# EAGLE design imwiser-esp-v01 (EAGLE 7.5.0)
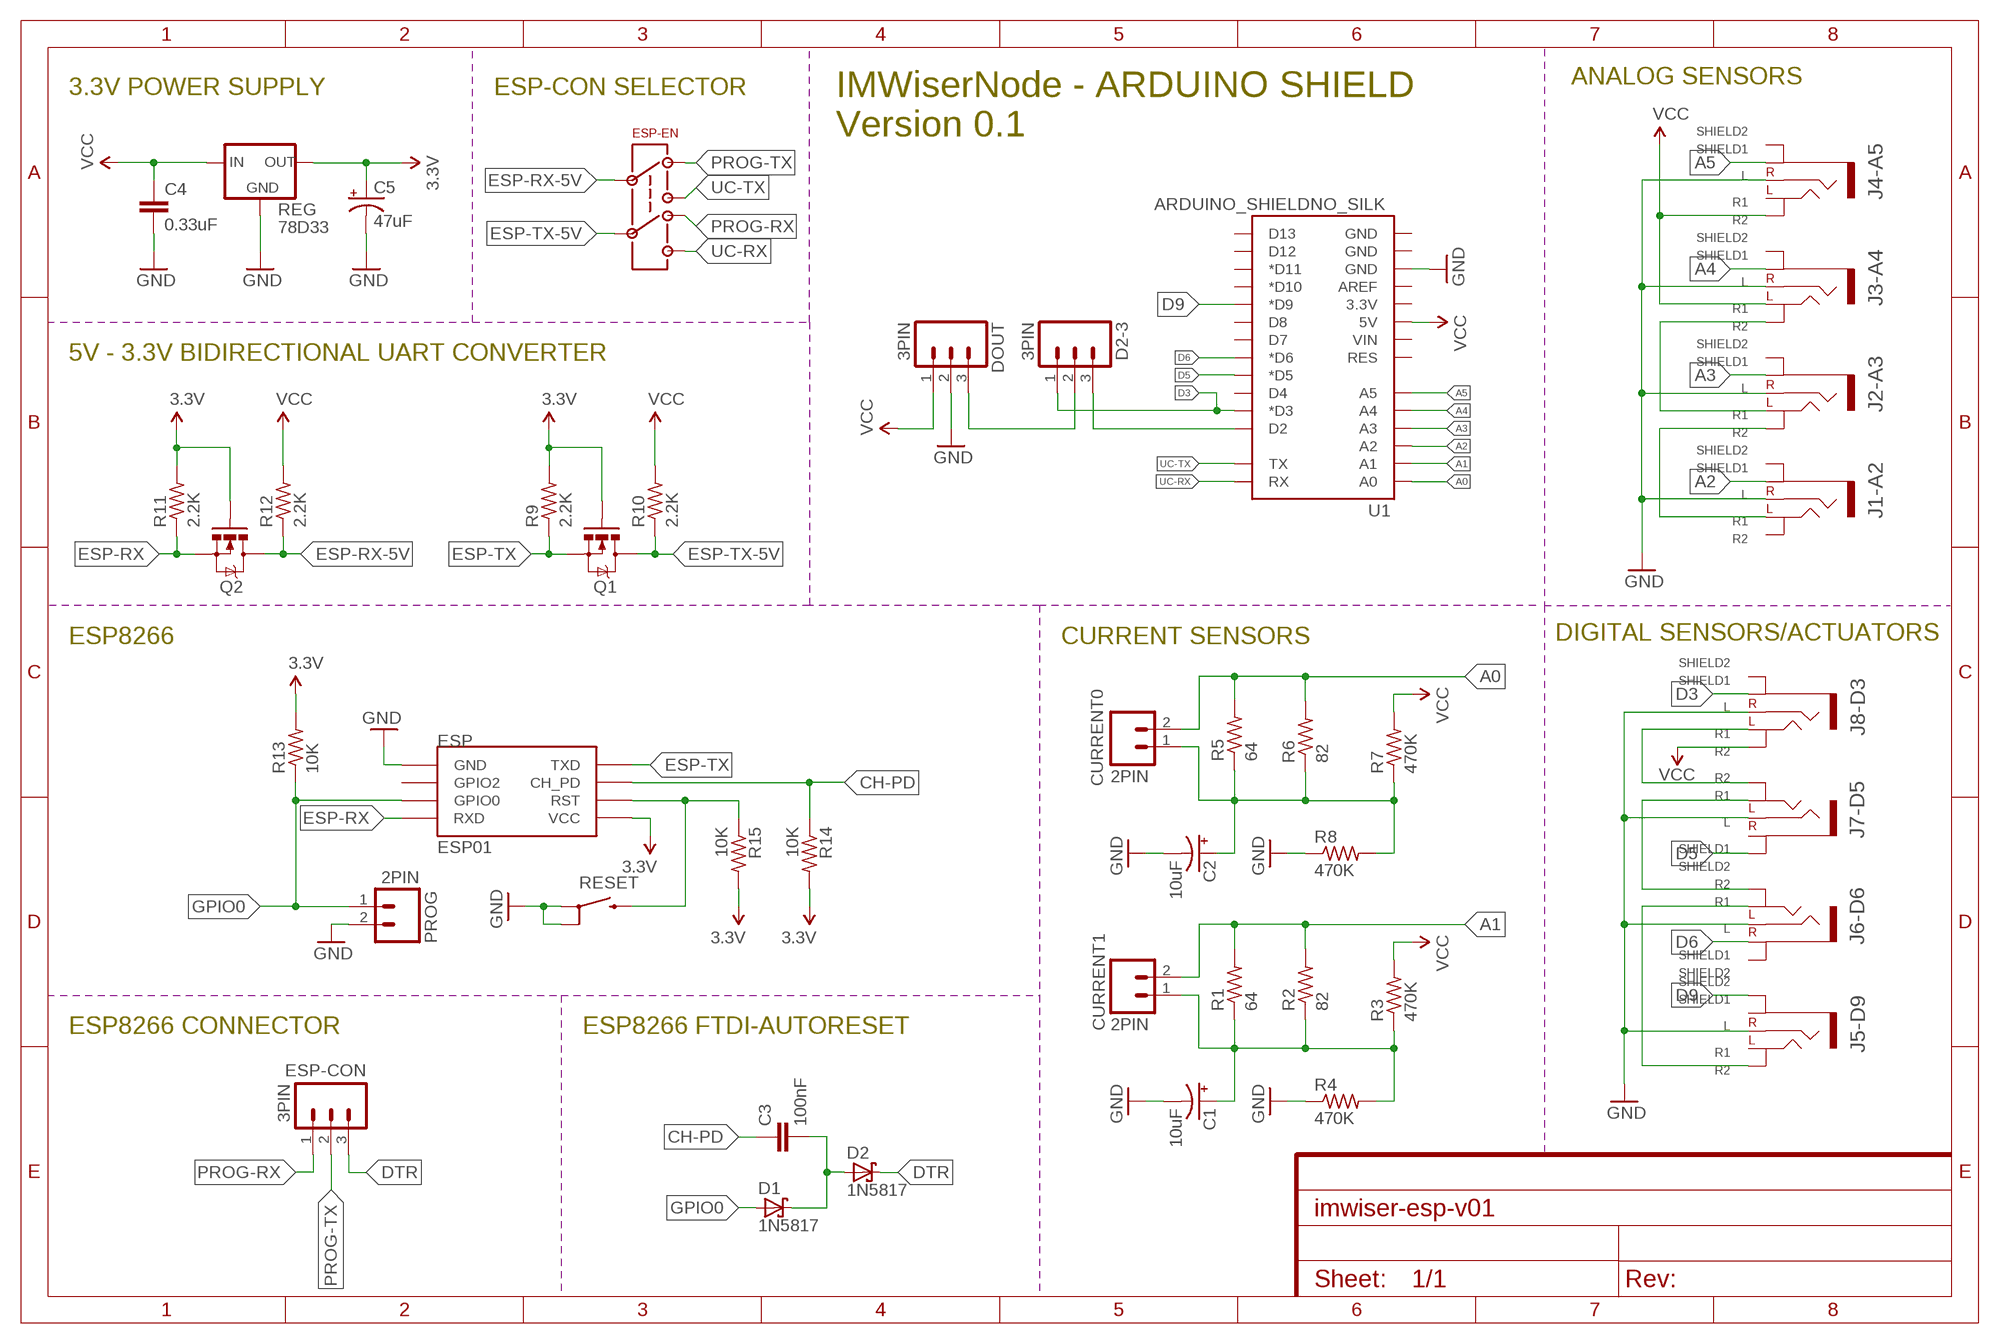
[diagram p0: schematic, sheet 1]
FRAME1 (FRAME-A4L): CNAME: IMSensorNode; CREVISION: REV A; DESIGNER: Jeferson Lima

## Parts
C1  10uF  10UF-25V-20%(PTH)  [CPOL-RADIAL-10UF-25V]
C2  10uF  10UF-25V-20%(PTH)  [CPOL-RADIAL-10UF-25V]
C3  100nF  CAPPTH  [CAP-PTH-SMALL]
C4  0.33uF  CAPPTH  [CAP-PTH-SMALL]
C5  47uF  10UF-25V-20%(PTH)  [CPOL-RADIAL-10UF-25V]
CURRENT0  2PIN  M02PTH  [1X02]
CURRENT1  2PIN  M02PTH  [1X02]
D1  1N5817  SCHOTTKY-DIODEDO41-7  [DO41-7]
D2  1N5817  SCHOTTKY-DIODEDO41-7  [DO41-7]
D2-3  3PIN  M03PTH  [1X03]
DOUT  3PIN  M03PTH  [1X03]
ESP  ESP01  [ESP01]
ESP-CON  3PIN  M03PTH  [1X03]
ESP-EN  DPDT-GENERIC-SWITCH-7X7MM  [DPDT-PTH-7*7MM]
J1-A2  PJ-313-SPAD  [PJ-313-5PIN-SMALL]
J2-A3  PJ-313-SPAD  [PJ-313-5PIN-SMALL]
J3-A4  PJ-313-SPAD  [PJ-313-5PIN-SMALL]
J4-A5  PJ-313-SPAD  [PJ-313-5PIN-SMALL]
J5-D9  PJ-313-SPAD  [PJ-313-5PIN-SMALL]
J6-D6  PJ-313-SPAD  [PJ-313-5PIN-SMALL]
J7-D5  PJ-313-SPAD  [PJ-313-5PIN-SMALL]
J8-D3  PJ-313-SPAD  [PJ-313-5PIN-SMALL]
PROG  2PIN  M02PTH  [1X02]
Q1  MOSFET-NCHANNEL2N7000  [TO-92]
Q2  MOSFET-NCHANNEL2N7000  [TO-92]
R1  64  R-US_0207/10  [0207/10]
R2  82  R-US_0207/10  [0207/10]
R3  470K  R-US_0207/10  [0207/10]
R4  470K  R-US_0207/10  [0207/10]
R5  64  R-US_0207/10  [0207/10]
R6  82  R-US_0207/10  [0207/10]
R7  470K  R-US_0207/10  [0207/10]
R8  470K  R-US_0207/10  [0207/10]
R9  2.2K  R-US_0207/10  [0207/10]
R10  2.2K  R-US_0207/10  [0207/10]
R11  2.2K  R-US_0207/10  [0207/10]
R12  2.2K  R-US_0207/10  [0207/10]
R13  10K  R-US_0207/10  [0207/10]
R14  10K  R-US_0207/10  [0207/10]
R15  10K  R-US_0207/10  [0207/10]
REG  78D33  V_REG_78XXSINK  [TO220-IGO]
RESET  SWITCH-MOMENTARY-2PTH  [TACTILE-PTH]
U1  ARDUINO_SHIELDNO_SILK  [DUEMILANOVE_VIAS]

## Nets
3.3V: C5.1(+) ESP.VCC Q1.2(G) Q2.2(G) R9.2 R11.2 R13.2 R14.2 R15.2 REG.OUT
A0: CURRENT0.2 R5.2 R6.2 U1.A0
A1: CURRENT1.2 R1.2 R2.2 U1.A1
A2: J1-A2.1.1(SHIELD1) U1.A2
A3: J2-A3.1.1(SHIELD1) U1.A3
A4: J3-A4.1.1(SHIELD1) U1.A4
A5: J4-A5.1.1(SHIELD1) U1.A5
BURDEN-C0: C2.1(+) CURRENT0.1 R5.1 R6.1 R7.1 R8.2
BURDEN-C1: C1.1(+) CURRENT1.1 R1.1 R2.1 R3.1 R4.2
CH-PD: C3.1 ESP.CH_PD R14.1
D3: D2-3.1 J8-D3.1.1(SHIELD1) U1.D3(*D3)
D5: J7-D5.1.2(SHIELD2) U1.D5(*D5)
D6: J6-D6.1.1(SHIELD1) U1.D6(*D6)
D9: J5-D9.1.2(SHIELD2) U1.D9(*D9)
DTR: D2.C ESP-CON.3
ESP-RX: ESP.RX(RXD) Q2.1(S) R11.1
ESP-RX-5V: ESP-EN.3-IN1(IN1) Q2.3(D) R12.1
ESP-TX: ESP.TX(TXD) Q1.1(S) R9.1
ESP-TX-5V: ESP-EN.4-IN2(IN2) Q1.3(D) R10.1
GND: C1.2(-) C2.2(-) C4.2 C5.2(-) DOUT.2 ESP.GND J1-A2.2(R) J2-A3.2(R) J3-A4.2(R) J4-A5.2(R) J5-D9.2(R) J6-D6.2(R) J7-D5.2(R) J8-D3.2(R) PROG.2 R4.1 R8.1 REG.GND RESET.1 RESET.2 U1.GND@2(GND)
GPIO0: D1.A ESP.GPIO0 PROG.1 R13.1
N$1: J2-A3.3.1(L1) J3-A4.3.2(L2)
N$2: J1-A2.3.1(L1) J2-A3.3.2(L2)
N$7: J7-D5.3.2(L2) J8-D3.3.1(L1)
N$8: D2-3.2 DOUT.3
N$9: J6-D6.3.2(L2) J7-D5.3.1(L1)
N$14: D2-3.3 U1.D2
N$16: J5-D9.3.2(L2) J6-D6.3.1(L1)
PROG-RX: ESP-CON.1 ESP-EN.2-OUT2-A(OUT2-A)
PROG-TX: ESP-CON.2 ESP-EN.1-OUT1-A(OUT1-A)
RST: ESP.RST R15.1 RESET.3
U$1: C3.2 D1.C D2.A
UC-RX: ESP-EN.6-OUT2-B(OUT2-B) U1.RX
UC-TX: ESP-EN.5-OUT1-B(OUT1-B) U1.TX
VCC: C4.1 DOUT.1 J3-A4.3.1(L1) J4-A5.3.2(L2) J8-D3.3.2(L2) R3.2 R7.2 R10.2 R12.2 REG.IN U1.5V
Unconnected: ESP.GPIO2 J1-A2.1.2(SHIELD2) J1-A2.3.2(L2) J2-A3.1.2(SHIELD2) J3-A4.1.2(SHIELD2) J4-A5.1.2(SHIELD2) J4-A5.3.1(L1) J5-D9.1.1(SHIELD1) J5-D9.3.1(L1) J6-D6.1.2(SHIELD2) J7-D5.1.1(SHIELD1) J8-D3.1.2(SHIELD2) U1.3.3V U1.AREF U1.D4 U1.D7 U1.D8 U1.D10(*D10) U1.D11(*D11) U1.D12 U1.D13 U1.GND@0(GND) U1.GND@1(GND) U1.RES U1.VIN

## Notes on the sheet
- IMWiserNode - ARDUINO SHIELD
  Version 0.1
- ANALOG SENSORS
- 3.3V POWER SUPPLY | ESP-CON SELECTOR
- 5V - 3.3V BIDIRECTIONAL UART CONVERTER
- ESP8266 | CURRENT SENSORS | DIGITAL SENSORS/ACTUATORS
- ESP8266 CONNECTOR | ESP8266 FTDI-AUTORESET

## Library data of the parts
C1 C2 C5 = SparkFun-Capacitors:10UF-25V-20%(PTH): CAP-08440; PROD_ID: CAP-08440
C3 C4 = SparkFun-Capacitors:CAP: Capacitor Standard 0603 ceramic capacitor, and 0.1" leaded capacitor.
CURRENT0 CURRENT1 PROG = SparkFun-Connectors:M02: Standard 2-pin 0.1" header. Use with - straight break away headers ( PRT-00116) - right angle break away headers (PRT-00553) - swiss pins (PRT-00743) - machine pins (PRT-00117) - female headers (PRT-00115) Molex polarized connector foot print use with: PRT-08233 with associated crimp pins and housings. 2.54_SCREWTERM for use with PRT-10571. 3.5mm Screw Terminal footprints for PRT-08084 5mm Screw Terminal footprints for use with PRT-08432
D1 D2 = adafruit:SCHOTTKY-DIODE: Schottky Diode
D2-3 DOUT ESP-CON = SparkFun-Connectors:M03: Header 3 Standard 3-pin 0.1" header. Use with straight break away headers (SKU : PRT-00116), right angle break away headers (PRT-00553), swiss pins (PRT-00743), machine pins (PRT-00117), and female headers (PRT-00115). Molex polarized connector foot print use with SKU : PRT-08232 with associated crimp pins and housings.
ESP = esp8266-modules:ESP01: ESP8266 Wifi module 01
ESP-EN = salvador-parts:DPDT-GENERIC-SWITCH-7X7MM
J1-A2 J2-A3 J3-A4 J4-A5 J5-D9 J6-D6 J7-D5 J8-D3 = salvador-parts:PJ-313-SPAD: PJ-313 with octagon pads PJ-313 with small octagon pads, good for projects which need small footprints
Q1 Q2 = SparkFun-DiscreteSemi:MOSFET-NCHANNEL: Common NMOSFET Parts MFG P/N Store ID Prod ID FDD8780 TRANS-09984 SI7820DN TRANS-11055 FDS6630A IC-08089 2N7002PW TRANS-11151 FQP30N06L COM-10213 TRANS-10060 BSS123LT1G TRANS-08345 BSS138 TRANS-00830 BS170 2N7000
R1-R15 = resistor:R-US_: RESISTOR, American symbol
REG = salvador-parts-imported:V_REG_78XX: Voltage Regulator Standard 78xx regulator. IGO (Input Ground Output). Spark Fun Electronics SKU : COM-00107
RESET = salvador-parts-imported2:SWITCH-MOMENTARY-2: Various NO switches- pushbuttons, reed, etc; PROD_ID: SWCH-08441
U1 = SparkFun-Boards:ARDUINO_SHIELD: Arduino shield footprint

## Board
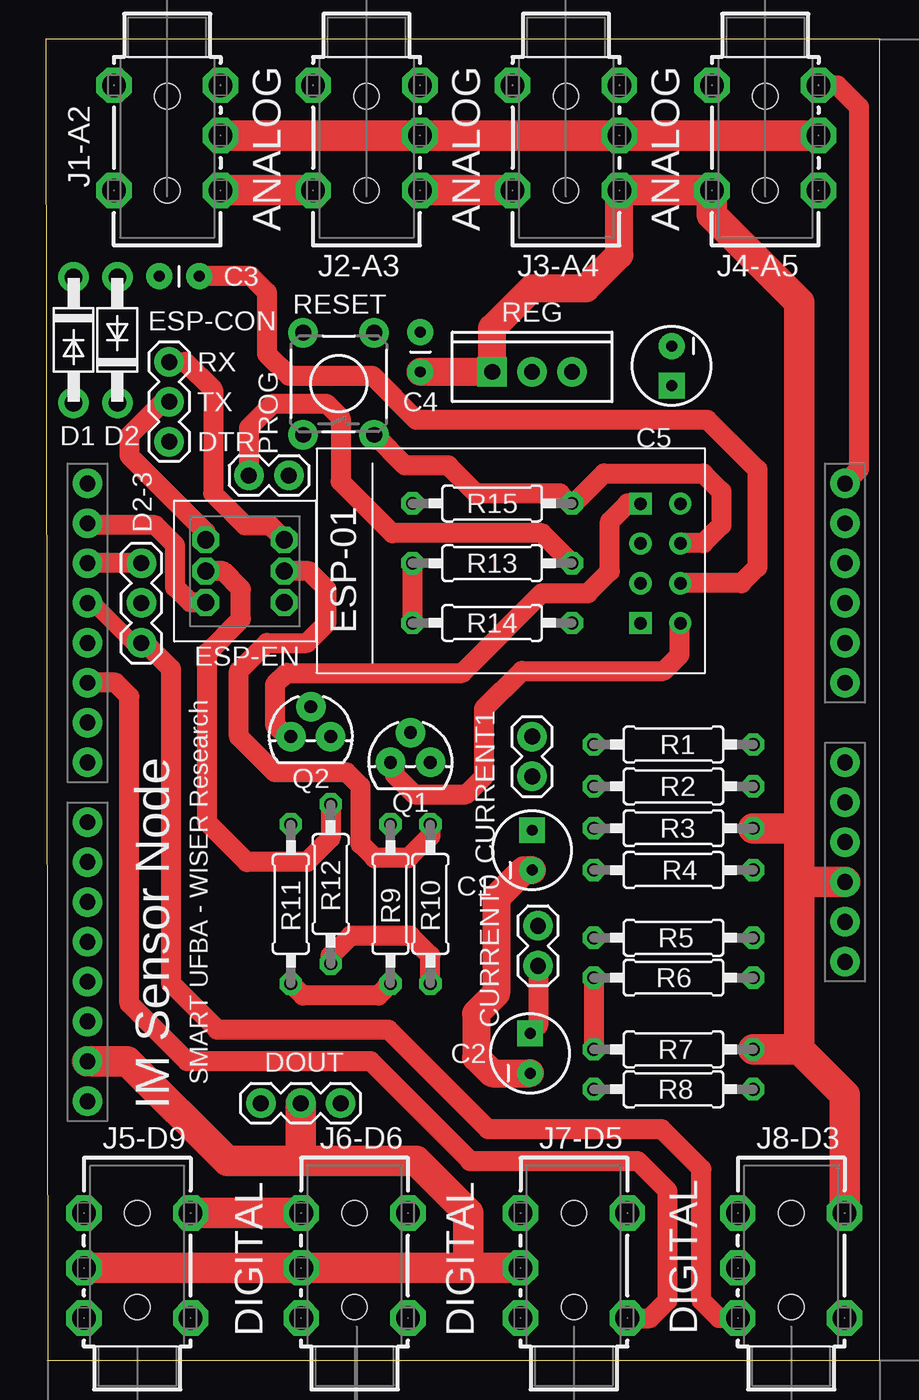
[diagram p1: board, top side]
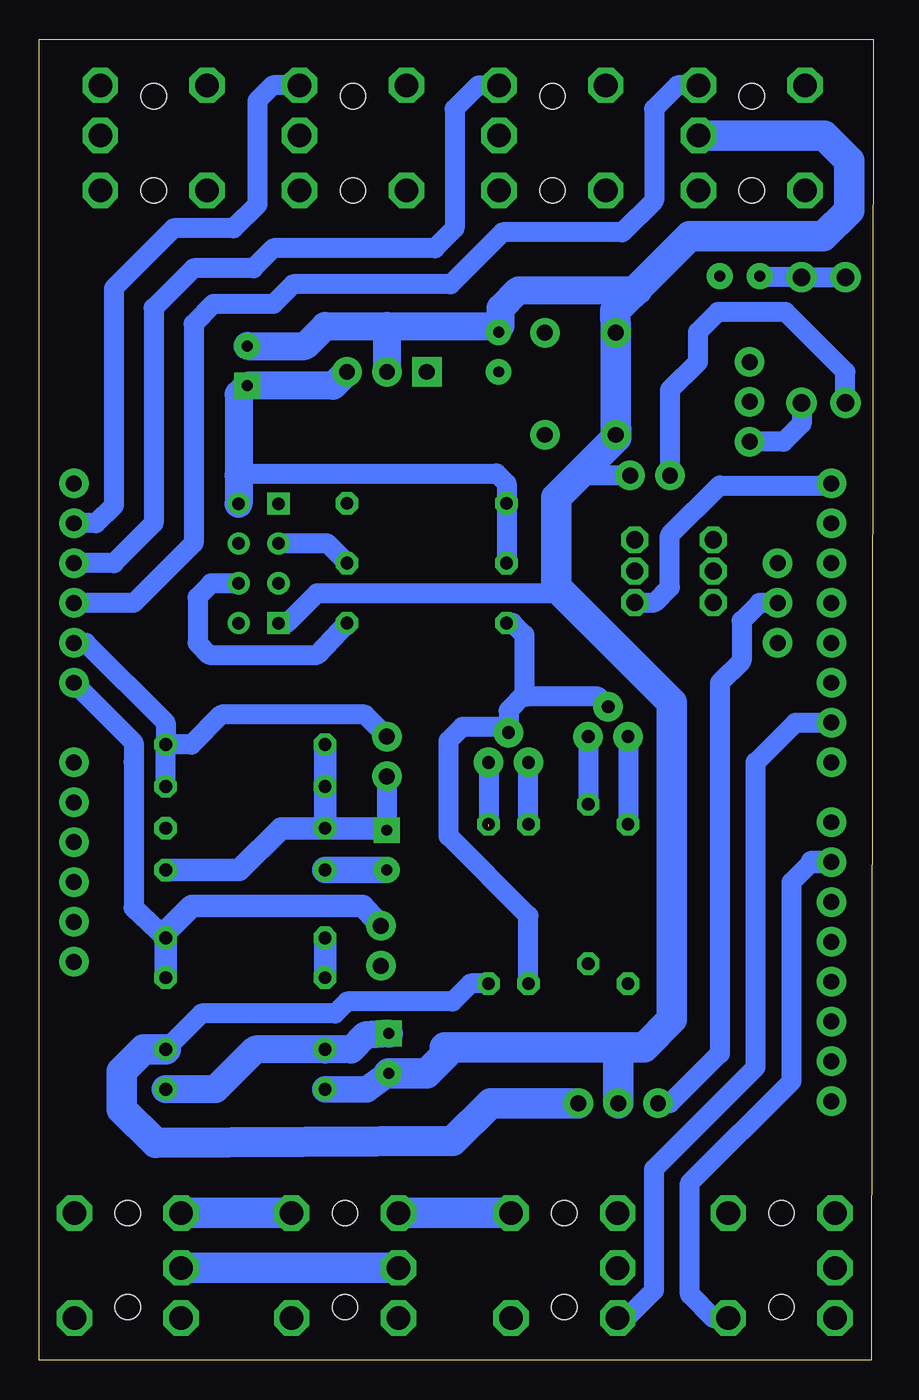
[diagram p2: board, bottom side, seen from below]

Size 53.14 x 84.19 mm. Coordinates in mm from the lower left corner, seen from the top.
Outline: 0.13,0 53.14,0 53.14,84.19 0,84.19 0.13,0
Copper layers (1*16): Top 0.035mm / dielectric 1.5mm / Bottom 0.035mm
Design rules "default": minimum track width 8mil, minimum drill 20mil, track to track 8mil, track to pad 8mil, pad to pad 8mil, via to via 8mil, smd to smd 8mil, copper to edge 10mil, drill to drill 8mil, minimum pad ring 12mil, minimum via ring 10mil, stop-mask expansion 4mil, vias tented up to drill 25mil, thermal gap 10mil

### Footprints (pad centres in the part's own frame; a part is rotated, then mirrored left to right if it is on the bottom)
CPOL-RADIAL-10UF-25V = drill 0.7 pad 1.651 square: 1 1.27,0 | drill 0.7 pad 1.651: 2 -1.27,0
CAP-PTH-SMALL = drill 0.7 pad 1.651: 1 0,0; 2 2.54,0
1X02 = drill 1.016 pad 1.88: 1 0,0; 2 2.54,0
DO41-7 = drill 1.118 pad 1.93: A 4,0; C -4,0
1X03 = drill 1.016 pad 1.88: 1 0,0; 2 2.54,0; 3 5.08,0
ESP01 = drill 0.8: CH_PD -1.285,-8.178; GPIO0 1.255,-5.638; GPIO2 -1.285,-5.638; RST 1.255,-8.178; TX -3.825,-8.178; VCC 3.795,-8.178 | drill 0.8 square: GND -3.825,-5.638; RX 3.795,-5.638
DPDT-PTH-7*7MM = drill 1.1 octagon: 1-OUT1-A -2.5,2; 2-OUT2-A 2.5,2; 3-IN1 -2.5,0; 4-IN2 2.5,0; 5-OUT1-B -2.5,-2; 6-OUT2-B 2.5,-2
PJ-313-5PIN-SMALL = drill 1.5 octagon: 1.1 1.8,3.4; 1.2 1.8,-3.4; 2 5,3.4; 3.1 8.5,3.4; 3.2 8.5,-3.4 | hole 1.6: 2.5,0; 8.5,0
TO-92 = drill 0.813 pad 1.88: 1 -1.27,0; 2 0,1.905; 3 1.27,0
0207/10 = drill 0.813 octagon: 1 -5.08,0; 2 5.08,0
TO220-IGO = drill 1 pad 1.88: GND 0,0; OUT 2.54,0 | drill 1 pad 1.88 square: IN -2.54,0
TACTILE-PTH = drill 1.016 pad 1.88: 1 -3.251,2.261; 2 3.251,2.261; 3 -3.251,-2.261; 4 3.251,-2.261
DUEMILANOVE_VIAS = drill 1.016 pad 1.88: 3.3V 50.8,13.97; 5V 50.8,16.51; A0 50.8,29.21; A1 50.8,31.75; A2 50.8,34.29; A3 50.8,36.83; A4 50.8,39.37; A5 50.8,41.91; AREF 2.54,2.54; D2 2.54,36.83; D3 2.54,34.29; D4 2.54,31.75; D5 2.54,29.21; D6 2.54,26.67; D7 2.54,24.13; D8 2.54,20.32; D9 2.54,17.78; D10 2.54,15.24; D11 2.54,12.7; D12 2.54,10.16; D13 2.54,7.62; GND@0 50.8,19.05; GND@1 50.8,21.59; GND@2 2.54,5.08; RES 50.8,11.43; RX 2.54,41.91; TX 2.54,39.37; VIN 50.8,24.13

### Placement (x,y rotation side)
C1  30.99,32.51 90 top
C2  30.86,19.56 90 top
C3  9.78,69.09 180 top
C4  23.88,62.99 90 top
C5  39.88,63.37 270 top
CURRENT0  31.37,25.15 90 top
CURRENT1  30.99,37.21 90 top
D1  1.78,65.02 270 top
D2  4.57,65.02 90 top
D2-3  6.1,45.72 90 top
DOUT  18.8,16.38 180 top
ESP  32.26,50.8 90 top
ESP-CON  7.87,63.63 270 top
ESP-EN  12.7,50.29 0 top
J1-A2  7.75,83.06 270 top
J2-A3  20.45,83.06 270 top
J3-A4  33.15,83.06 270 top
J4-A5  45.85,83.06 270 top
J5-D9  5.84,0.89 90 top
J6-D6  19.68,0.89 90 top
J7-D5  33.66,0.89 90 top
J8-D3  47.5,0.89 90 top
PROG  12.95,56.39 0 top
Q1  23.24,38.1 0 top
Q2  16.89,39.75 0 top
R1  40.01,39.24 0 top
R2  40.01,36.58 0 top
R3  40.01,33.91 0 top
R4  40.01,31.24 0 top
R5  40.01,26.92 0 top
R6  40.01,24.38 0 top
R7  40.01,19.81 0 top
R8  40.01,17.27 0 top
R9  21.97,29.08 270 top
R10  24.51,29.08 270 top
R11  15.62,29.08 270 top
R12  18.16,30.35 270 top
R13  28.45,50.8 180 top
R14  28.45,46.99 180 top
R15  28.45,54.61 180 top
REG  30.99,62.99 0 top
RESET  18.67,62.23 90 top
U1  0.13,13.97 0 top

### Tracks (layer width: path | path; a pad name or v marks a point on that pad's centre or on a via)
3.3V
  Top 1.27: R13.2 R14.2 | R9.2 21.21,23.24 16.38,23.24 R11.2
  Bottom 1.27: R13.2 R15.2 23.37,55.88 24,56.52 39.75,56.52 39.88,56.39 40.44,56.39 | Q2.2 17.53,42.29 22.1,42.29 22.22,42.42 | R9.2 21.97,28.32 27.05,33.4 27.05,39.5 26.16,40.39 23.49,40.39 Q1.2 23.24,41.4 22.22,42.42 | R14.2 22.99,46.99 22.22,46.23 22.22,42.42
  Bottom 1.778: REG.OUT 34.42,62.1 C5.1 40.44,61.55 40.44,56.39 ESP.VCC
A0
  Bottom 1.27: R5.2 47.12,28.83 47.12,38.1 47.12,39.37 U1.A0
  Bottom 1.422: R6.2 R5.2 45.09,27.3 43.43,28.96 32.51,28.96 CURRENT0.2
A1
  Bottom 1.27: R2.2 R1.2 | CURRENT1.2 32.39,41.15 41.53,41.15 43.43,39.24 R1.2 | R1.2 45.09,40.64 50.16,45.72 U1.A1
A2
  Bottom 1.27: J1-A2.1.1 12.47,81.26 13.97,79.76 13.97,73.91 16,71.88 23.62,71.88 26.92,68.58 36.96,68.58 38.23,67.31 42.04,67.31 43.31,66.04 43.31,52.07 47.12,48.26 U1.A2
A3
  Bottom 1.27: U1.A3 48.39,50.8 45.85,53.34 45.85,67.06 43.31,69.6 39.5,69.6 38.23,70.87 27.94,70.87 26.67,72.14 26.67,79.76 25.17,81.26 J2-A3.1.1
A4
  Bottom 1.27: J3-A4.1.1 38.25,81.26 39.24,80.26 39.24,73.66 40.77,72.14 44.58,72.14 48.39,68.33 48.39,54.48 49.53,53.34 U1.A4
A5
  Top 1.27: J4-A5.1.1 50.44,81.26 51.82,79.88 51.82,56.77 U1.A5
BURDEN-C0
  Top 1.27: R6.1 R7.1 | CURRENT0.1 31.37,21.34 C2.1
  Bottom 1.422: R5.1 R6.1
  Bottom 1.778: C2.1 32.39,20.7 33.27,19.81 R7.1 39.37,19.81 41.91,17.27 R8.2
BURDEN-C1
  Bottom 1.27: CURRENT1.1 30.99,33.91
  Bottom 1.422: R4.2 40.39,31.24 37.72,33.91 R3.1 | R3.1 R2.1 R1.1 | R3.1 30.99,33.91 C1.1
CH-PD
  Top 1.27: ESP.CH_PD 40.45,49.53 44.32,49.53 45.34,50.55 45.34,56.77 42.16,59.94 23.62,59.94 20.83,62.74 15.49,62.74 14.1,64.14 14.1,68.07 13.08,69.09 C3.1
  Bottom 1.27: ESP.CH_PD 42.18,49.52 43.05,48.64 43.05,45.72 42.29,44.96 35.43,44.96 R14.1
D3
  Top 1.016: U1.D3 3.05,48.26 5.59,45.72 D2-3.1
  Top 1.27: J8-D3.1.1 42.9,2.69 41.78,3.81 41.78,12.19 39.24,14.73 28.19,14.73 21.84,21.08 10.92,21.08 8,24 8,44.07 6.35,45.72 D2-3.1
D5
  Top 1.27: J7-D5.1.2 38.5,2.69 39.62,3.81 39.62,10.79 37.72,12.7 27.05,12.7 20.7,19.05 9.02,19.05 5.33,22.73 5.33,42.29 4.44,43.18 U1.D5
D6
  Bottom 1.27: J6-D6.1.1 15.73,2.69 13.97,4.45 13.97,12.19 7.49,18.67 7.49,38.1 4.95,40.64 U1.D6
D9
  Bottom 1.27: 3.94,31.75 5.21,30.48 5.21,17.78 11.68,11.3 11.68,4.19 10.18,2.69 J5-D9.1.2
  Bottom 1.422: 3.94,31.75 U1.D9
DTR
  Bottom 1.27: D2.C 4.57,59.69 5.71,58.55 ESP-CON.3
ESP-RX
  Top 1.27: Q2.1 15.37,39.75 14.61,40.51 14.61,43.05 15.37,43.81 26.54,43.81 31.62,48.9 34.54,48.9 35.94,50.29 35.94,53.47 37.08,54.61 37.88,54.61 ESP.RX
  Bottom 1.27: Q2.1 R11.1
ESP-RX-5V
  Top 1.27: R12.1 18.16,33.27 16.64,31.75 12.83,31.75 10.29,34.29 10.29,45.09 12.45,47.24 12.45,49.15 11.3,50.29 ESP-EN.3-IN1
  Bottom 1.27: Q2.3 R12.1
ESP-TX
  Top 1.27: ESP.TX 40.39,46.92 40.39,44.96 39.37,43.94 30.35,43.94 27.94,41.53 27.94,37.21 26.8,36.07 23.49,36.07 22.22,37.34 22.22,38.1 Q1.1
  Bottom 1.27: R9.1 Q1.1
ESP-TX-5V  (1 unrouted)
  Top 1.27: 24.51,34.04 24.51,33.4 23.11,32 20.95,32 20.07,32.89 20.07,36.58 19.18,37.47 14.61,37.47 12.32,39.75 12.32,43.94 14.1,45.72 16.64,45.72 17.91,46.99 17.91,49.15 16.76,50.29 ESP-EN.4-IN2
  Bottom 1.27: Q1.3 R10.1
GND
  Top 1.778: C1.2 30.48,31.24 28.7,29.46 28.7,23.37 27.43,22.1 27.43,19.3 28.45,18.29 C2.2
  Top 1.93: J1-A2.2 J2-A3.2 J3-A4.2 J4-A5.2 | DOUT.2 16.26,12.7 | 16.26,12.7 23.62,12.7 26.92,9.4 26.92,6.02 27.05,5.89 | U1.GND@2 5.21,19.05 11.56,12.7 16.26,12.7 | J5-D9.2 J6-D6.2 27.05,5.89 | J7-D5.2 27.05,5.89
  Bottom 1.27: ESP.GND 37.88,46.99 37.34,46.99 35.43,48.9 20.57,48.9 20.19,49.28 | 23.75,65.91 C4.2 | PROG.2 18.41,56.39 18.61,56.58
  Bottom 1.676: C2.2 32.26,17.27 R8.1 | R4.1 C1.2
  Bottom 1.778: C2.2 29.72,18.29 | C5.2 36.2,64.64 34.93,65.91 30.99,65.91 | 30.99,65.91 REG.GND | 30.99,65.91 23.75,65.91 23.75,67.06 22.61,68.2 14.96,68.2 16.43,66.88
  Bottom 1.93: 16.26,19.94 27.3,19.94 27.3,19.43 28.45,18.29 C2.2 | 16.26,19.94 14.61,19.94 12.83,21.72 12.83,41.91 20.19,49.28 20.19,54.99 18.61,56.58 16.38,58.8 16.38,59.33 RESET.1 RESET.2 16.43,66.88 11.68,71.63 3.17,71.63 1.52,73.28 1.52,76.45 3.13,78.06 J1-A2.2 | DOUT.2 16.26,19.94 | J8-D3.2 J7-D5.2
GPIO0
  Top 1.27: R13.1 31.62,52.7 22.1,52.7 18.8,56.01 18.8,60.07 17.91,60.96 14.48,60.96 12.95,59.44 PROG.1
  Bottom 1.27: R13.1 34.8,52.07 37.88,52.07 ESP.GPIO0 | PROG.1 12.95,61.85 11.18,63.63 11.18,65.53 9.91,66.8 5.59,66.8 1.78,62.99 D1.A
N$1
  Top 1.93: J2-A3.3.1 J3-A4.3.2
N$2
  Top 1.93: J2-A3.3.2 J1-A2.3.1
N$7
  Bottom 1.93: J8-D3.3.1 J7-D5.3.2
N$8
  Bottom 1.27: D2-3.2 7.24,48.26 8.38,47.12 8.38,44.58 9.78,43.18 9.78,19.56 12.95,16.38 DOUT.3
N$9
  Bottom 1.93: J7-D5.3.1 J6-D6.3.2
N$14
  Top 1.27: D2-3.3 U1.D2
N$16
  Top 1.93: J5-D9.3.2 J6-D6.3.1
PROG-RX
  Top 1.27: ESP-CON.1 8.89,63.63 10.67,61.85 10.67,55.24 12.7,53.21 14.28,53.21 ESP-EN.2-OUT2-A
PROG-TX
  Top 1.27: ESP-CON.2 7.49,61.09 5.33,58.93 5.33,57.66 10.2,52.79 ESP-EN.1-OUT1-A
RST
  Top 1.27: ESP.RST 40.45,52.07 41.91,52.07 43.05,53.21 43.05,55.37 41.91,56.52 35.56,56.52 33.66,54.61 R15.1 33.4,54.61 32.77,55.24 27.43,55.24 25.65,57.02 22.88,57.02 RESET.3
U$1
  Bottom 1.27: D1.C D2.A 7.17,69.02 C3.2
UC-RX
  Bottom 1.27: ESP-EN.6-OUT2-B 13.94,48.29 12.95,49.28 12.95,52.58 9.78,55.75 2.79,55.75 U1.RX
UC-TX
  Top 1.27: ESP-EN.5-OUT1-B 9.24,48.29 8.26,49.28 8.26,51.94 6.98,53.21 2.79,53.21 U1.TX
VCC
  Top 1.27: R10.2 24.51,25.78 23.24,27.05 19.43,27.05 18.16,25.78 R12.2
  Top 1.778: J3-A4.3.1 36.55,70.46 34.42,68.33 30.99,68.33 28.45,65.79 REG.IN C4.1
  Top 1.93: J3-A4.3.1 J4-A5.3.2 42.45,73 48.01,67.44 48.01,33.91 | 48.01,33.91 48.01,30.48 | U1.5V 48.01,30.48 | J8-D3.3.2 50.9,16.92 48.01,19.81 | R3.2 48.01,33.91 | 48.01,30.48 48.01,19.81 | R7.2 48.01,19.81
  Bottom 1.27: R10.2 25.65,24 26.8,22.86 33.53,22.86 34.29,22.1 42.8,22.1 R7.2
  Bottom 1.93: DOUT.1 24.38,16.38 26.8,13.97 45.72,13.84 47.88,16 47.88,18.41 46.48,19.81 R7.2

### Text on the board
tPlace: ANALOG | ANALOG | ANALOG | RX | TX | DTR | SMART UFBA - WISER Research | IM Sensor Node | DIGITAL | DIGITAL | DIGITAL